# Altium schematic sheet UWB.schdoc
size 94 x 73 mm
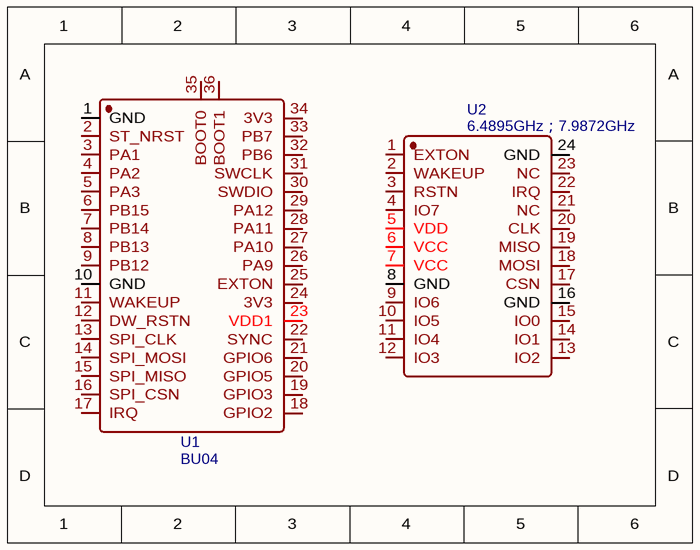
[diagram p0: UWB.schdoc]

## Parts
U1  BU04  [WIRELM-SMD_BU04]
U2  6.4895GHz；7.9872GHz  [WIRELM-SMD_BU03]

## Nets

Not connected (* = marked no-connect by the designer): U1 1(GND) 2(ST_NRST) 3(PA1) 4(PA2) 5(PA3) 6(PB15) 7(PB14) 8(PB13) 9(PB12) 10(GND) 11(WAKEUP) 12(DW_RSTN) 13(SPI_CLK) 14(SPI_MOSI) 15(SPI_MISO) 16(SPI_CSN) 17(IRQ) 18(GPIO2) 19(GPIO3) 20(GPIO5) 21(GPIO6) 22(SYNC) 23(VDD1) 24(3V3) 25(EXTON) 26(PA9) 27(PA10) 28(PA11) 29(PA12) 30(SWDIO) 31(SWCLK) 32(PB6) 33(PB7) 34(3V3) 35(BOOT0) 36(BOOT1); U2 1(EXTON) 2(WAKEUP) 3(RSTN) 4(IO7) 5(VDD) 6(VCC) 7(VCC) 8(GND) 9(IO6) 10(IO5) 11(IO4) 12(IO3) 13(IO2) 14(IO1) 15(IO0) 16(GND) 17(CSN) 18(MOSI) 19(MISO) 20(CLK) 21(NC) 22(IRQ) 23(NC) 24(GND)

## Library data of the parts
U1 = BU04: Manufacturer: Ai-Thinker(安信可); Contributor: lcsc; Supplier: LCSC; Supplier Part: C42420050; Manufacturer Part: BU04; JLCPCB Part Class: Extended Part; spicePre: U; spiceSymbolName: BU04
U2 = 6.4895GHz；7.9872GHz: Manufacturer: Ai-Thinker(安信可); Manufacturer Part: BU03; Contributor: lcsc; nameAlias: Value; Supplier: LCSC; Supplier Part: C42419011; JLCPCB Part Class: Extended Part; spicePre: U; spiceSymbolName: BU03